# Altium project JacdacPower 50.PrjPCB
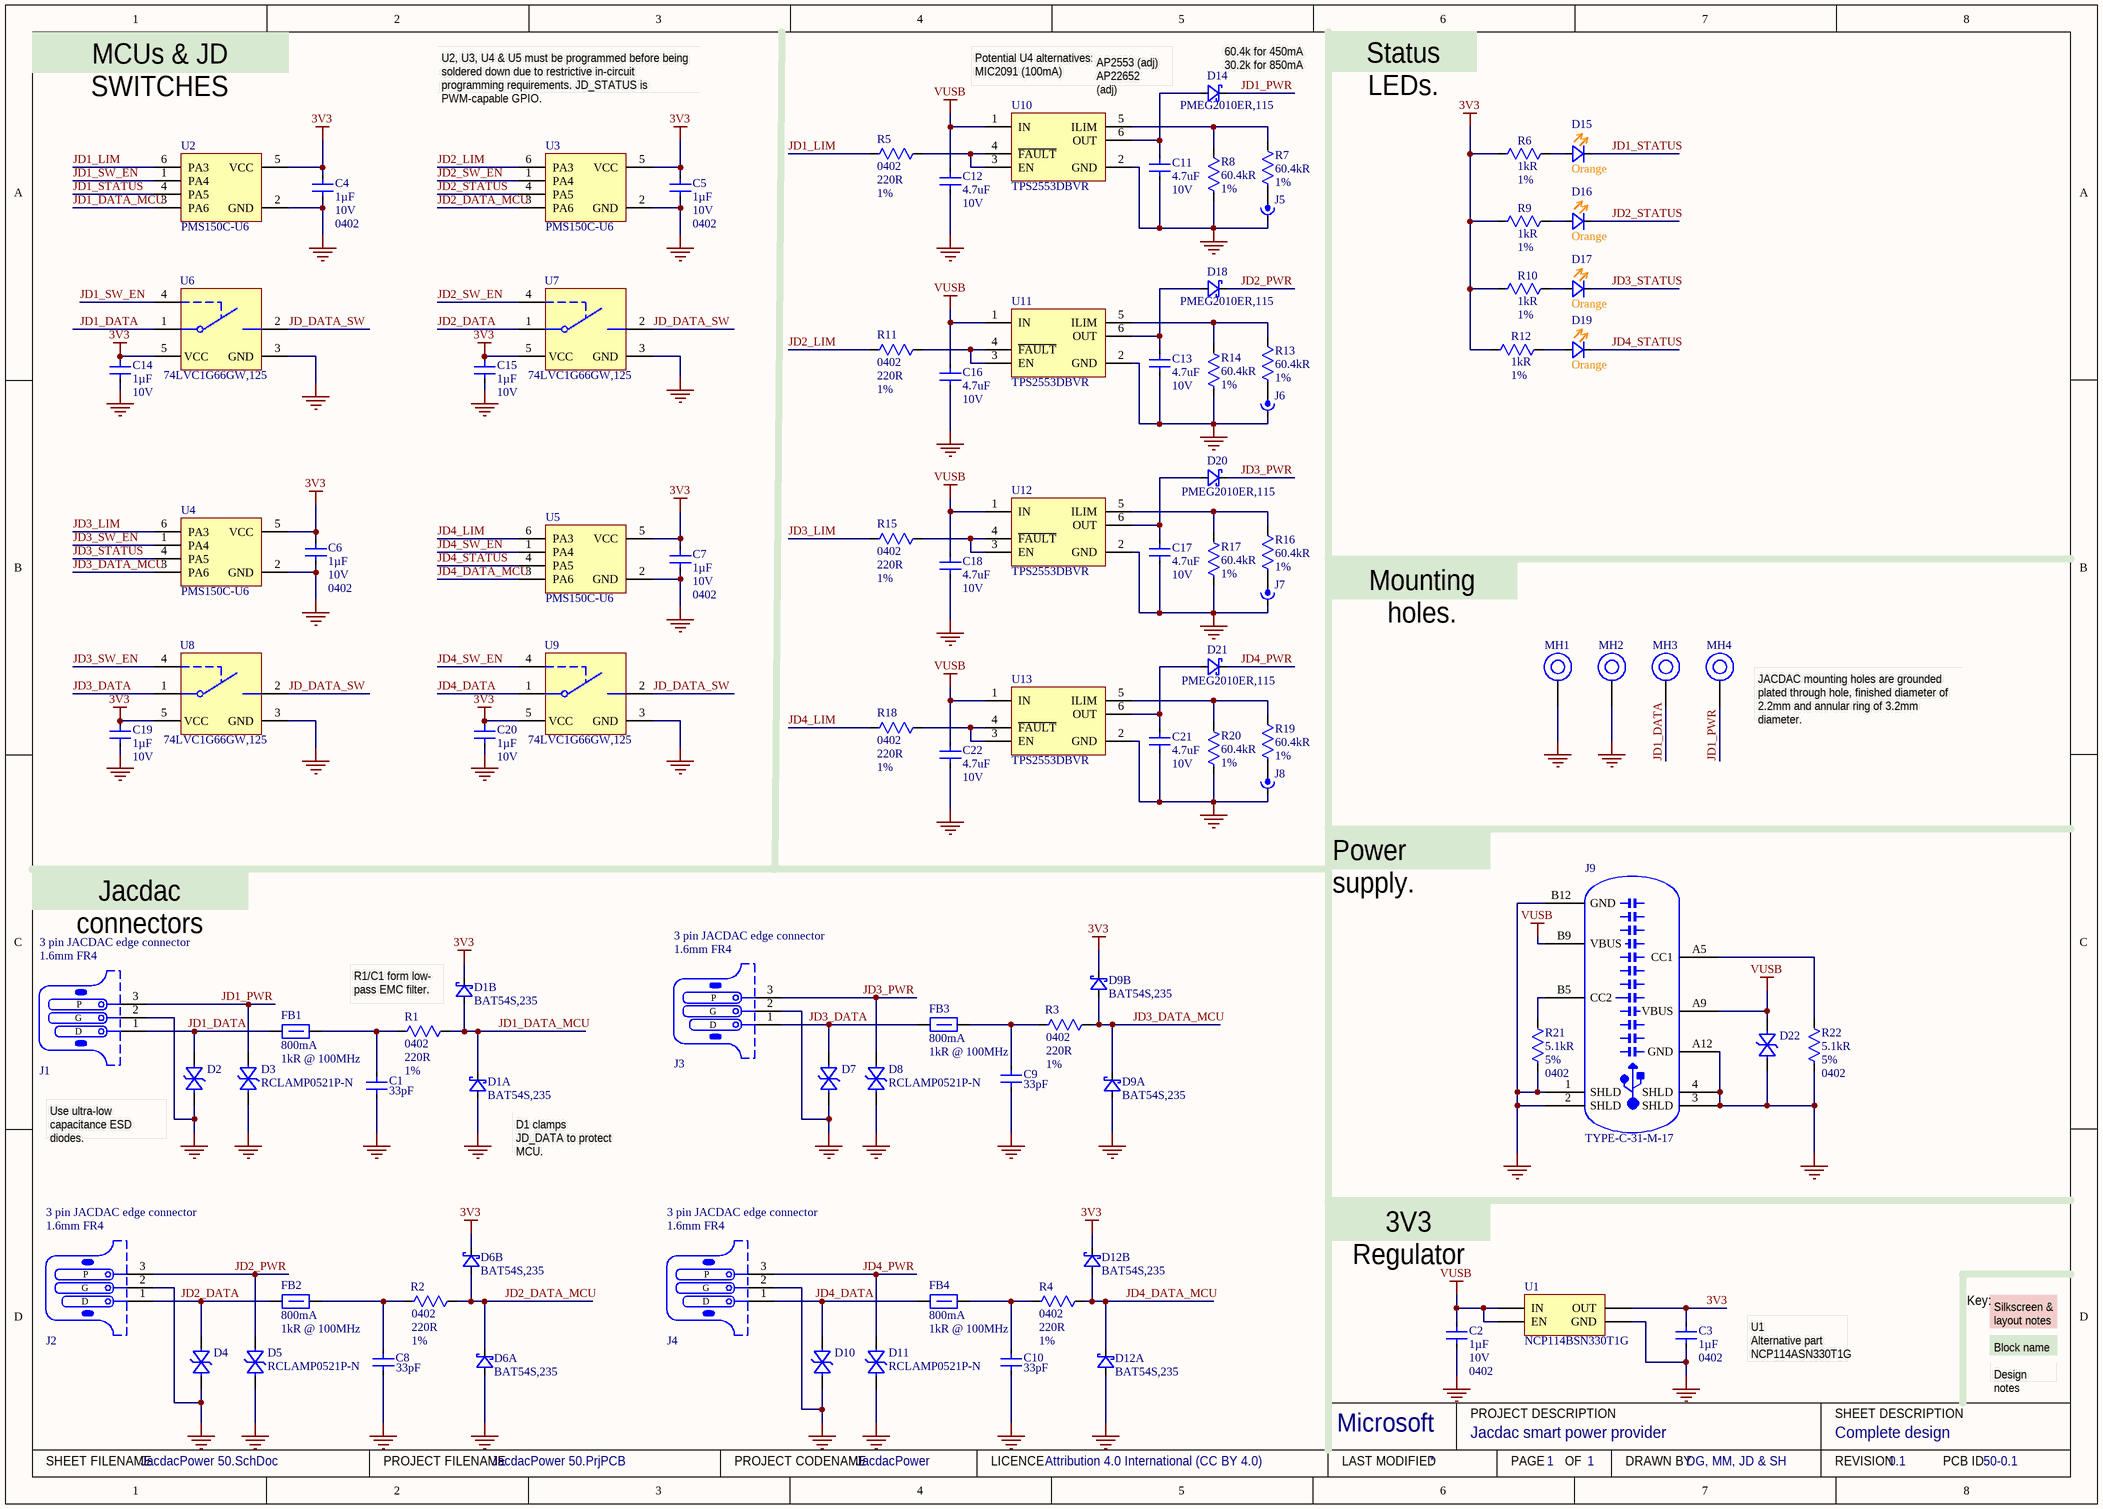
[diagram p0: JacdacPower 50.SchDoc]
ProjectCodeName: JacdacPower; ProjectCodenameDescription: Jacdac smart power provider; ProjectCodenameID: 50; ProjectDrawnBy: DG, MM, JD & SH; ProjectLicenceTerms: Attribution 4.0 International (CC BY 4.0); ProjectRevision: 0.1
1 sheet, 95 parts. Net scope: global (net labels, ports and power ports of the same name join across sheets).
Board files: JacdacPower 50.PcbDoc, Panelized JacdacPower 50.PcbDoc

## Sheet JacdacPower 50.SchDoc: Complete design
size A3; DrawnBy: DG, MM, JD & SH; DocumentNumber: 1; Revision: 0.1; SheetNumber: 1; SheetTotal: 1; VersionControl_RevNumber: 1

### Parts
C1  Capacitance: 33pF  [C0402_0.55MM - without outline]  (hidden comment: CL05C330JB5NNNC)
C2  Capacitance: 1µF  Voltage Rating: 10V  Case Code (Imperial): 0402  [C0402_0.55MM - without outline]  (hidden comment: CL05A105KP5NNNC)
C3  Capacitance: 1µF  Case Code (Imperial): 0402  [C0402_0.55MM - without outline]  (hidden comment: CL05A105KP5NNNC)
C4  Capacitance: 1µF  Voltage Rating: 10V  Case Code (Imperial): 0402  [C0402_0.55MM - without outline]  (hidden comment: CL05A105KP5NNNC)
C5  Capacitance: 1µF  Voltage Rating: 10V  Case Code (Imperial): 0402  [C0402_0.55MM - without outline]  (hidden comment: CL05A105KP5NNNC)
C6  Capacitance: 1µF  Voltage Rating: 10V  Case Code (Imperial): 0402  [C0402_0.55MM - without outline]  (hidden comment: CL05A105KP5NNNC)
C7  Capacitance: 1µF  Voltage Rating: 10V  Case Code (Imperial): 0402  [C0402_0.55MM - without outline]  (hidden comment: CL05A105KP5NNNC)
C8  Capacitance: 33pF  [C0402_0.55MM - without outline]  (hidden comment: CL05C330JB5NNNC)
C9  Capacitance: 33pF  [C0402_0.55MM - without outline]  (hidden comment: CL05C330JB5NNNC)
C10  Capacitance: 33pF  [C0402_0.55MM - without outline]  (hidden comment: CL05C330JB5NNNC)
C11  Capacitance: 4.7uF  Voltage Rating: 10V  [R0402 - Without outline]  (hidden comment: CL05A475MP5NRNC)
C12  Capacitance: 4.7uF  Voltage Rating: 10V  [R0402 - Without outline]  (hidden comment: CL05A475MP5NRNC)
C13  Capacitance: 4.7uF  Voltage Rating: 10V  [R0402 - Without outline]  (hidden comment: CL05A475MP5NRNC)
C14  Capacitance: 1µF  Voltage Rating: 10V  [C0402_0.55MM - without outline]  (hidden comment: CL05A105KP5NNNC)
C15  Capacitance: 1µF  Voltage Rating: 10V  [C0402_0.55MM - without outline]  (hidden comment: CL05A105KP5NNNC)
C16  Capacitance: 4.7uF  Voltage Rating: 10V  [R0402 - Without outline]  (hidden comment: CL05A475MP5NRNC)
C17  Capacitance: 4.7uF  Voltage Rating: 10V  [R0402 - Without outline]  (hidden comment: CL05A475MP5NRNC)
C18  Capacitance: 4.7uF  Voltage Rating: 10V  [R0402 - Without outline]  (hidden comment: CL05A475MP5NRNC)
C19  Capacitance: 1µF  Voltage Rating: 10V  [C0402_0.55MM - without outline]  (hidden comment: CL05A105KP5NNNC)
C20  Capacitance: 1µF  Voltage Rating: 10V  [C0402_0.55MM - without outline]  (hidden comment: CL05A105KP5NNNC)
C21  Capacitance: 4.7uF  Voltage Rating: 10V  [R0402 - Without outline]  (hidden comment: CL05A475MP5NRNC)
C22  Capacitance: 4.7uF  Voltage Rating: 10V  [R0402 - Without outline]  (hidden comment: CL05A475MP5NRNC)
D1  Manufacturer Part Number: BAT54S,235  [NXP-BAT54S-TO-236AB - without outline]  (hidden comment: BAT54S)  (parts A,B of 2)
D2  RCLAMP0521P-N  [TVS 0402 - without outline]  (value not drawn)
D3  RCLAMP0521P-N  [TVS 0402 - without outline]
D4  RCLAMP0521P-N  [TVS 0402 - without outline]  (value not drawn)
D5  RCLAMP0521P-N  [TVS 0402 - without outline]
D6  Manufacturer Part Number: BAT54S,235  [NXP-BAT54S-TO-236AB - without outline]  (hidden comment: BAT54S)  (parts A,B of 2)
D7  RCLAMP0521P-N  [TVS 0402 - without outline]  (value not drawn)
D8  RCLAMP0521P-N  [TVS 0402 - without outline]
D9  Manufacturer Part Number: BAT54S,235  [NXP-BAT54S-TO-236AB - without outline]  (hidden comment: BAT54S)  (parts A,B of 2)
D10  RCLAMP0521P-N  [TVS 0402 - without outline]  (value not drawn)
D11  RCLAMP0521P-N  [TVS 0402 - without outline]
D12  Manufacturer Part Number: BAT54S,235  [NXP-BAT54S-TO-236AB - without outline]  (hidden comment: BAT54S)  (parts A,B of 2)
D14  PMEG2010ER,115  [SOD-123W]
D15  Colour: Orange  [0603 Orange]  (hidden comment: 19-217/S2C-AQ1R1B/3T)
D16  Colour: Orange  [0603 Orange]  (hidden comment: 19-217/S2C-AQ1R1B/3T)
D17  Colour: Orange  [0603 Orange]  (hidden comment: 19-217/S2C-AQ1R1B/3T)
D18  PMEG2010ER,115  [SOD-123W]
D19  Colour: Orange  [0603 Orange]  (hidden comment: 19-217/S2C-AQ1R1B/3T)
D20  PMEG2010ER,115  [SOD-123W]
D21  PMEG2010ER,115  [SOD-123W]
D22  RCLAMP0521P-N  [TVS 0402 - without outline]  (value not drawn)
FB1  Current Rating: 800mA  Impedance: 1kR @ 100MHz  [TDK MPZ1608 0.8mm - without outline]  (hidden comment: TDK MPZ1608S102ATA00)
FB2  Current Rating: 800mA  Impedance: 1kR @ 100MHz  [TDK MPZ1608 0.8mm - without outline]  (hidden comment: TDK MPZ1608S102ATA00)
FB3  Current Rating: 800mA  Impedance: 1kR @ 100MHz  [TDK MPZ1608 0.8mm - without outline]  (hidden comment: TDK MPZ1608S102ATA00)
FB4  Current Rating: 800mA  Impedance: 1kR @ 100MHz  [TDK MPZ1608 0.8mm - without outline]  (hidden comment: TDK MPZ1608S102ATA00)
J1  3 pin JACDAC edge connector  PCB Type: 1.6mm FR4  [JACDAC_EDGE_CONNECTOR_0.15mm_T&G]  (no BOM)
J2  3 pin JACDAC edge connector  PCB Type: 1.6mm FR4  [JACDAC_EDGE_CONNECTOR_0.15mm_T&G]  (no BOM)
J3  3 pin JACDAC edge connector  PCB Type: 1.6mm FR4  [JACDAC_EDGE_CONNECTOR_0.15mm_T&G]  (no BOM)
J4  3 pin JACDAC edge connector  PCB Type: 1.6mm FR4  [JACDAC_EDGE_CONNECTOR_0.15mm_T&G]  (no BOM)
J5  OpenSolderBlob  [SolderBlobA]  (value not drawn)  (no BOM)
J6  OpenSolderBlob  [SolderBlobA]  (value not drawn)  (no BOM)
J7  OpenSolderBlob  [SolderBlobA]  (value not drawn)  (no BOM)
J8  OpenSolderBlob  [SolderBlobA]  (value not drawn)  (no BOM)
J9  TYPE-C-31-M-17  [TYPE-C-31-M-17]
MH1  MH_5.0MMK_3.0MMC_2.1MMD_PTH  [MH_5.0MMK_3.0MMC_2.1MMD_PTH]  (value not drawn)  (no BOM)
MH2  MH_5.0MMK_3.0MMC_2.1MMD_PTH  [MH_5.0MMK_3.0MMC_2.1MMD_PTH]  (value not drawn)  (no BOM)
MH3  MH_5.0MMK_3.0MMC_2.1MMD_PTH  [MH_5.0MMK_3.0MMC_2.1MMD_PTH]  (value not drawn)  (no BOM)
MH4  MH_5.0MMK_3.0MMC_2.1MMD_PTH  [MH_5.0MMK_3.0MMC_2.1MMD_PTH]  (value not drawn)  (no BOM)
R1  Case Code (Imperial): 0402  Resistance: 220R  Tolerance: 1%  [R0402 - Without outline]  (hidden comment: RC0402FR-07220RL)
R2  Case Code (Imperial): 0402  Resistance: 220R  Tolerance: 1%  [R0402 - Without outline]  (hidden comment: RC0402FR-07220RL)
R3  Case Code (Imperial): 0402  Resistance: 220R  Tolerance: 1%  [R0402 - Without outline]  (hidden comment: RC0402FR-07220RL)
R4  Case Code (Imperial): 0402  Resistance: 220R  Tolerance: 1%  [R0402 - Without outline]  (hidden comment: RC0402FR-07220RL)
R5  Case Code (Imperial): 0402  Resistance: 220R  Tolerance: 1%  [R0402 - Without outline]  (hidden comment: RC0402FR-07220RL)
R6  Tolerance: 1%  Resistance: 1kR  [R0402 - Without outline]  (hidden comment: RC0402FR-071KL)
R7  Resistance: 60.4kR  Tolerance: 1%  [R0402 - Without outline]  (hidden comment: RC0402FR-0760K4L)
R8  Resistance: 60.4kR  Tolerance: 1%  [R0402 - Without outline]  (hidden comment: RC0402FR-0760K4L)
R9  Tolerance: 1%  Resistance: 1kR  [R0402 - Without outline]  (hidden comment: RC0402FR-071KL)
R10  Tolerance: 1%  Resistance: 1kR  [R0402 - Without outline]  (hidden comment: RC0402FR-071KL)
R11  Case Code (Imperial): 0402  Resistance: 220R  Tolerance: 1%  [R0402 - Without outline]  (hidden comment: RC0402FR-07220RL)
R12  Tolerance: 1%  Resistance: 1kR  [R0402 - Without outline]  (hidden comment: RC0402FR-071KL)
R13  Resistance: 60.4kR  Tolerance: 1%  [R0402 - Without outline]  (hidden comment: RC0402FR-0760K4L)
R14  Resistance: 60.4kR  Tolerance: 1%  [R0402 - Without outline]  (hidden comment: RC0402FR-0760K4L)
R15  Case Code (Imperial): 0402  Resistance: 220R  Tolerance: 1%  [R0402 - Without outline]  (hidden comment: RC0402FR-07220RL)
R16  Resistance: 60.4kR  Tolerance: 1%  [R0402 - Without outline]  (hidden comment: RC0402FR-0760K4L)
R17  Resistance: 60.4kR  Tolerance: 1%  [R0402 - Without outline]  (hidden comment: RC0402FR-0760K4L)
R18  Case Code (Imperial): 0402  Resistance: 220R  Tolerance: 1%  [R0402 - Without outline]  (hidden comment: RC0402FR-07220RL)
R19  Resistance: 60.4kR  Tolerance: 1%  [R0402 - Without outline]  (hidden comment: RC0402FR-0760K4L)
R20  Resistance: 60.4kR  Tolerance: 1%  [R0402 - Without outline]  (hidden comment: RC0402FR-0760K4L)
R21  Resistance: 5.1kR  Tolerance: 5%  Case Code (Imperial): 0402  [R0402 - Without outline]  (hidden comment: RC0402JR-075K1L)
R22  Resistance: 5.1kR  Tolerance: 5%  Case Code (Imperial): 0402  [R0402 - Without outline]  (hidden comment: RC0402JR-075K1L)
U1  LDO 3.3V/300 mA  [ON_SEMI-SOT23-5 - without outline]  (value not drawn)
U2  Manufacturer Part Number: PMS150C-U6  [SOT23-6]  (hidden comment: PMS150C)
U3  Manufacturer Part Number: PMS150C-U6  [SOT23-6]  (hidden comment: PMS150C)
U4  Manufacturer Part Number: PMS150C-U6  [SOT23-6]  (hidden comment: PMS150C)
U5  Manufacturer Part Number: PMS150C-U6  [SOT23-6]  (hidden comment: PMS150C)
U6  74LVC1G66GW,125  [TSSOP-5/SOT353-1]
U7  74LVC1G66GW,125  [TSSOP-5/SOT353-1]
U8  74LVC1G66GW,125  [TSSOP-5/SOT353-1]
U9  74LVC1G66GW,125  [TSSOP-5/SOT353-1]
U10  TPS2553DBVR  [TI-TPS2553 - without_outline]
U11  TPS2553DBVR  [TI-TPS2553 - without_outline]
U12  TPS2553DBVR  [TI-TPS2553 - without_outline]
U13  TPS2553DBVR  [TI-TPS2553 - without_outline]

### Nets
3V3: C3.2 C4.2 C5.2 C6.2 C7.2 C14.2 C15.2 C19.2 C20.2 D1.2(K) D6.2(K) D9.2(K) D12.2(K) R6.2 R9.2 R10.2 R12.2 U1.5(OUT) U2.5(VCC) U3.5(VCC) U4.5(VCC) U5.5(VCC) U6.5(VCC) U7.5(VCC) U8.5(VCC) U9.5(VCC)
GND: C1.1 C2.1 C3.1 C4.1 C5.1 C6.1 C7.1 C8.1 C9.1 C10.1 C11.1 C12.1 C13.1 C14.1 C15.1 C16.1 C17.1 C18.1 C19.1 C20.1 C21.1 C22.1 D1.1(A) D2.2(A) D3.2(A) D4.2(A) D5.2(A) D6.1(A) D7.2(A) D8.2(A) D9.1(A) D10.2(A) D11.2(A) D12.1(A) D22.2(A) J1.2(G) J2.2(G) J3.2(G) J4.2(G) J5.2 J6.2 J7.2 J8.2 J9.1(SHLD) J9.2(SHLD) J9.3(SHLD) J9.4(SHLD) J9.A12(GND) J9.B12(GND) MH1.1 MH2.1 R8.1 R14.1 R17.1 R20.1 R21.2 R22.2 U1.2(GND) U2.2(GND) U3.2(GND) U4.2(GND) U5.2(GND) U6.3(GND) U7.3(GND) U8.3(GND) U9.3(GND) U10.2(GND) U11.2(GND) U12.2(GND) U13.2(GND)
VUSB: C2.2 C12.2 C16.2 C18.2 C22.2 D22.1(K) J9.A9(VBUS) J9.B9(VBUS) U1.1(IN) U1.3(EN) U10.1(IN) U11.1(IN) U12.1(IN) U13.1(IN)
JD1_DATA: D2.1(K) FB1.1 J1.1(D) MH3.1 U6.1(Y)
JD1_DATA_MCU: D1.3(K) R1.1 U2.3(PA6)
JD1_LIM: R5.2 U2.6(PA3)
JD1_PWR: D3.1(K) D14.1(K) J1.3(P) MH4.1
JD1_STATUS: D15.1(K) U2.4(PA5)
JD1_SW_EN: U2.1(PA4) U6.4(EN)
JD2_DATA: D4.1(K) FB2.1 J2.1(D) U7.1(Y)
JD2_DATA_MCU: D6.3(K) R2.1 U3.3(PA6)
JD2_LIM: R11.2 U3.6(PA3)
JD2_PWR: D5.1(K) D18.1(K) J2.3(P)
JD2_STATUS: D16.1(K) U3.4(PA5)
JD2_SW_EN: U3.1(PA4) U7.4(EN)
JD3_DATA: D7.1(K) FB3.1 J3.1(D) U8.1(Y)
JD3_DATA_MCU: D9.3(K) R3.1 U4.3(PA6)
JD3_LIM: R15.2 U4.6(PA3)
JD3_PWR: D8.1(K) D20.1(K) J3.3(P)
JD3_STATUS: D17.1(K) U4.4(PA5)
JD3_SW_EN: U4.1(PA4) U8.4(EN)
JD4_DATA: D10.1(K) FB4.1 J4.1(D) U9.1(Y)
JD4_DATA_MCU: D12.3(K) R4.1 U5.3(PA6)
JD4_LIM: R18.2 U5.6(PA3)
JD4_PWR: D11.1(K) D21.1(K) J4.3(P)
JD4_STATUS: D19.1(K) U5.4(PA5)
JD4_SW_EN: U5.1(PA4) U9.4(EN)
JD_DATA_SW: U6.2(Z) U7.2(Z) U8.2(Z) U9.2(Z)
NetC1_2: C1.2 FB1.2 R1.2
NetC8_2: C8.2 FB2.2 R2.2
NetC9_2: C9.2 FB3.2 R3.2
NetC10_2: C10.2 FB4.2 R4.2
NetC11_2: C11.2 D14.2(A) U10.6(OUT)
NetC13_2: C13.2 D18.2(A) U11.6(OUT)
NetC17_2: C17.2 D20.2(A) U12.6(OUT)
NetC21_2: C21.2 D21.2(A) U13.6(OUT)
NetD15_2: D15.2(A) R6.1
NetD16_2: D16.2(A) R9.1
NetD17_2: D17.2(A) R10.1
NetD19_2: D19.2(A) R12.1
NetJ5_1: J5.1 R7.1
NetJ6_1: J6.1 R13.1
NetJ7_1: J7.1 R16.1
NetJ8_1: J8.1 R19.1
NetJ9_A5: J9.A5(CC1) R22.1
NetJ9_B5: J9.B5(CC2) R21.1
NetR5_1: R5.1 U10.3(EN) U10.4(~{FAULT})
NetR7_2: R7.2 R8.2 U10.5(ILIM)
NetR11_1: R11.1 U11.3(EN) U11.4(~{FAULT})
NetR13_2: R13.2 R14.2 U11.5(ILIM)
NetR15_1: R15.1 U12.3(EN) U12.4(~{FAULT})
NetR16_2: R16.2 R17.2 U12.5(ILIM)
NetR18_1: R18.1 U13.3(EN) U13.4(~{FAULT})
NetR19_2: R19.2 R20.2 U13.5(ILIM)

### Notes on the sheet
- MCUs & JD SWITCHES
- U2, U3, U4 & U5 must be programmed before being soldered down due to restrictive in-circuit programming requirements. JD_STATUS is PWM-capable GPIO.
- Potential U4 alternatives:
  MIC2091 (100mA)
- AP2553 (adj)
  AP22652 (adj)
- (near D14) 60.4k for 450mA
  30.2k for 850mA
- Status LEDs.
- Mounting holes.
- (near MH4) JACDAC mounting holes are grounded plated through hole, finished diameter of 2.2mm and annular ring of 3.2mm diameter.
- Jacdac connectors
- Power supply.
- R1/C1 form low-
  pass EMC filter.
- (near D2) Use ultra-low capacitance ESD diodes.
- (near D1) D1 clamps JD_DATA to protect MCU.
- 3V3 Regulator
- Key:
- Silkscreen & layout notes
- U1
  Alternative part
  NCP114ASN330T1G
- Block name
- Design notes
- Microsoft
- PROJECT DESCRIPTION
- SHEET DESCRIPTION
- SHEET FILENAME
- PROJECT FILENAME
- PROJECT CODENAME
- LICENCE
- LAST MODIFIED
- PAGE
- OF
- DRAWN BY
- REVISION
- PCB ID

### Library data of the parts
C1 C8-C10 = CL05C330JB5NNNC: CAP CER 33PF 50V C0G/NP0 0402; Manufacturer: Samsung; Material: Ceramic; Tolerance: 5%; Dielectric: C0G; Temperature Coefficient: 300ppm/°C; Supplier 1: Digi-Key; Manufacturer Part Number: CL05C330JB5NNNC; RoHS: Yes; Category: Ceramic Capacitors; Stock 1: 5436088; Pricing 1: 1=0.10000, 10=0.02300, 50=0.01260, 100=0.01040, 500=0.00740, 1000=0.00582, 2500=0.00529, 5000=0.00487 (USD); Mount: Surface Mount; Case Code (Metric): 1005; Case Code (Imperial): 0402; Contact Plating: Tin; Min Operating Temperature: -55°C; Max Operating Temperature: 125°C; Package Quantity: 1; Packaging: Tape and Reel; Voltage: 50V; Voltage Rating (DC): 50V; Series: CL; Construction: Flat; Length: 1mm; Width: 0.02inch; Height: 0.5mm; Thickness: 0.022inch; Depth: 0.5mm; Radiation Hardening: No; Lead Free: Lead Free; RoHS Compliant: Yes; ComponentLink1URL: https://datasheet.ciiva.com/15195/getdatasheetpartid-355282-15195687.pdf; ComponentLink1Description: Online datasheet; Supplier 2: Newark; Stock 2: 45340; Pricing 2: 1=0.12500, 25=0.02900, 100=0.01300, 250=0.01100, 500=0.00900, 1000=0.00600 (USD); Supplier 3: Mouser; Stock 3: 8877; Pricing 3: 1=0.10000, 10=0.01400, 50=0.01400, 100=0.01100, 1000=0.00600, 10000=0.00400 (USD); Supplier 4: Farnell; Stock 4: 10934; Pricing 4: 150=0.01120, 500=0.00860, 2500=0.00640, 5000=0.00550 (GBP); Supplier Part Number 4: 3013373RL; Supplier Part Number 3: 187-CL05C330JB5NNNC; Supplier Part Number 2: 82AC9259; Supplier Part Number 1: 1276-1272-1-ND; Voltage Rating: 50V; Case/Package: 0402
C2-C7 C14 C15 C19 C20 = CL05A105KP5NNNC: CAP CER 1UF 10V X5R 0402; Manufacturer: Samsung; Material: Ceramic; Tolerance: 10%; Supplier 1: Digi-Key; Manufacturer Part Number: CL05A105KP5NNNC; RoHS: Yes; Category: Capacitors; Stock 1: 5705569; Pricing 1: 1=0.10000, 10=0.03900, 50=0.02100, 100=0.01720, 500=0.01228, 1000=0.00965, 2500=0.00877, 5000=0.00807 (USD); Mount: Surface Mount; Case/Package: 0402; Case Code (Metric): 1005; Contact Plating: Tin; Min Operating Temperature: -55°C; Max Operating Temperature: 85°C; Dielectric: X5R; Package Quantity: 1; Packaging: Tape and Reel; Length: 1mm; Height: 0.5mm; Width: 0.02inch; Thickness: 0.022inch; Depth: 0.5mm; Radiation Hardening: No; ComponentLink1URL: https://datasheet.ciiva.com/15195/getdatasheetpartid-358390-15195630.pdf; ComponentLink1Description: Online datasheet; Supplier 2: Mouser; Stock 2: 928941; Pricing 2: 1=0.10000, 10=0.04200, 100=0.01800, 500=0.01300, 1000=0.01000, 2500=0.00900 (USD); Supplier 3: Farnell; Stock 3: 53670; Pricing 3: 10=0.02450, 100=0.02000, 500=0.01310, 2500=0.00920, 5000=0.00810, 10000=0.00640, 50000=0.00490 (GBP); Supplier Part Number 3: 3013329; Supplier Part Number 2: 187-CL05A105KP5NNNC; Supplier Part Number 1: 1276-1076-1-ND; Created: DG; Checked: ?
  C3: Voltage Rating: 10V
  C14 C15 C19 C20: Case Code (Imperial): 0402
C11-C13 C16-C18 C21 C22 = CL05A475MP5NRNC: CAP CER 4.7UF 10V X5R 0402; Manufacturer: Samsung; Tolerance: 20%; Supplier 1: Digi-Key; Manufacturer Part Number: CL05A475MP5NRNC; RoHS: Yes; Category: Ceramic Capacitors; Stock 1: 840000; Pricing 1: 10000=0.01405, 20000=0.01338 (USD); Mount: Surface Mount; Case/Package: 0402; Case Code (Metric): 1005; Min Operating Temperature: -55°C; Max Operating Temperature: 85°C; Package Quantity: 10000; Packaging: Tape and Reel; Dielectric: X5R; Series: CL; Length: 0.039inch; Width: 0.02inch; Thickness: 0.022inch; Lead Free: Lead Free; RoHS Compliant: Yes; ComponentLink1URL: https://datasheet.ciiva.com/25786/cl05a475mp5nrnc-25786963.pdf; ComponentLink1Description: Online datasheet; Supplier 2: Future Electronics; Stock 2: 2004; Pricing 2: 1=0.23500, 500=0.03970, 1500=0.02900, 2500=0.02500, 5000=0.02050 (USD); Created By: D. Gakure; Checked By: ?; Supplier Part Number 2: 2103694; Supplier Part Number 1: 1276-1482-2-ND; Case Code (Imperial): 0402
D1 D6 D9 D12 = BAT54S: DIODE ARRAY SCHOTTKY 30V SOT23; Manufacturer: Nexperia; Supplier 1: Digi-Key; RoHS: No; Category: Rectifier Diodes; Stock 1: 14011; Pricing 1: 1=0.13000, 10=0.11900, 100=0.05610, 500=0.03326, 1000=0.02185, 5000=0.02138 (USD); ComponentLink1URL: https://assets.nexperia.com/documents/data-sheet/BAT54_SER.pdf; ComponentLink1Description: NXP datasheet online; Supplier 2: Mouser; Supplier 3: RSComponents; Supplier Part Number 2: 771-BAT54S235; Supplier Part Number 3: 1707990; Supplier Part Number 1: 1727-1868-1-ND
D2-D5 D7 D8 D10 D11 D22 = RCLAMP0521P-N: Bidirectional 5V (Max) 6V 16V 3.5A (8/20us) 0402 TVS RoHS; Manufacturer: Born Semiconductor; Package: 0402; Created By: D Gakure; Checked By: ?; Supplier1: LCSC; Supplier1 Part Number: C316043; ComponentLink1Description: Online datasheet; ComponentLink1URL: https://datasheet.lcsc.com/szlcsc/Bourne-Semicon-Shenzhen-RCLAMP0521P-N_C316043.pdf; Manufacturer Part Number: RCLAMP0521P-N
D14 D18 D20 D21 = PMEG2010ER,115: NEXPERIA - PMEG2010ER,115 - DIODE, RECT SCH, 20V, 1A, SOD123W; Supplier 1: Digi-Key; Manufacturer: Nexperia; RoHS: Yes; Stock 1: 722; Pricing 1: 1=0.42000, 10=0.31300, 100=0.19480, 500=0.13328, 1000=0.10252 (USD); RoHS Compliant: Yes; ComponentLink1URL: http://www.farnell.com/datasheets/1383341.pdf; ComponentLink1Description: Online datasheet; Supplier 2: Future Electronics; Stock 2: 144000; Pricing 2: 3000=0.20000, 6000=0.16300, 9000=0.16200, 12000=0.16100, 15000=0.16000 (USD); Supplier 3: RSComponents; Stock 3: 1; Pricing 3: 50=0.32100, 100=0.26700, 250=0.21200, 500=0.11100, 1000=0.08200 (USD); Supplier 4: Mouser; Stock 4: 2146; Pricing 4: 1=0.37000, 10=0.25700, 50=0.25700, 100=0.13400, 1000=0.09400, 10000=0.07200 (USD); Supplier 5: Farnell; Stock 5: 24250; Pricing 5: 5=0.40400, 10=0.27600, 100=0.13400, 500=0.11500, 1000=0.07750 (GBP); Supplier Part Number 5: 1907681; Supplier Part Number 4: 771-PMEG2010ER115; Supplier Part Number 3: 8166824P; Supplier Part Number 2: 4222907; Supplier Part Number 1: 1727-5192-1-ND; Manufacturer Part Number: PMEG2010ER,115
D15-D17 D19 = 19-217/S2C-AQ1R1B/3T: LED ORANGE DIFFUSED 0603 SMD; Manufacturer: Everlight Elec; Manufacturer Part Number: 19-217/S2C-AQ1R1B/3T; Mount: Surface Mount; Case/Package: 0603; Color: Orange; Case Code (Imperial): 0603; ComponentLink1URL: https://datasheet.lcsc.com/lcsc/1912171731_Everlight-Elec-19-217-S2C-AQ1R1B-3T_C146215.pdf; ComponentLink1Description: Online datasheet; Supplier 1: LCSC; Supplier 1 Part Number: C146215
FB1-FB4 = TDK MPZ1608S102ATA00: 0603 1k@100MHz 0.8A chip; Core Material: Ferrite; Tolerance: 25%; DC Resistance (DCR): 300mR; Supplier 1: Digi-Key; Stock 1: 113542; Pricing 1: 1=0.1, 10=0.079, 25=0.0716, 50=0.0644, 100=0.0472, 250=0.03432, 500=0.03146, 1000=0.02717 (USD); Mount: Surface Mount; Case/Package: 0603; Case Code (Metric): 1608; Case Code (Imperial): 0603; Package Quantity: 4000; Packaging: Tape and Reel; Max DC Current: 800mA; Length: 0.063inch; Height: 0.037inch; Width: 0.031inch; ComponentLink2URL: https://www.mouser.co.uk/datasheet/2/400/eads_commercial_power_mpz1608_en-923650.pdf; ComponentLink2Description: datasheet online; Supplier 2: Mouser; ComponentLink3Description: datasheet; ComponentLink3URL: Y:\System\Altium\Libraries 2014\TDK\Datasheets\eads_commercial_power_mpz1608_en-923650.pdf; Supplier Part Number 1: 445-8694-1-ND; Supplier Part Number 2: 810-MPZ1608S102ATA00; Manufacturer: TDK; Manufacturer Part Number: MPZ1608S102ATA00
J1-J4 = Jacdac edge connector: 3 pin Jacdac edge connector 1.27mm pitch; Manufacturer Part Number: JACDAC_EDGE_CONNECTOR; Checked By: ?; Created By: D. Gakure; ComponentLink1Description: Yuliang JACDAC cable connector drawing online; ComponentLink1URL: https://github.com/microsoft/jacdac-mdk/blob/main/connector/JACDAC-Connector-by-Yuliang-2020-11-28.pdf; ComponentLink2Description: JACDAC PCB edge connector spec onlin; ComponentLink2URL: https://github.com/microsoft/jacdac-mdk/blob/main/connector/JACDAC_PCB_Edge_Connector_Drawing_JD-PEC-01_rev_01.pdf
J5-J8 = OpenSolderBlob: Open solder blob
J9 = TYPE-C-31-M-17: USB - Type C Female 6 USB Connectors RoHS; Manufacturer: Korean Hroparts Elec; Gender: Receptacle; Number of Positions: 6; RoHS: Yes; Category: USB Connectors; Orientation: Right Angle; ComponentLink1URL: https://datasheet.lcsc.com/szlcsc/1811101526_Korean-Hroparts-Elec-TYPE-C-31-M-17_C283540.pdf; ComponentLink1Description: Online datasheet; Supplier 1 Part Number: C283540; Supplier 1: LCSC; Manufacturer Part Number: TYPE-C-31-M-17
MH1-MH4 = MH_5.0MMK_3.0MMC_2.1MMD_PTH: Mounting Hole 5.0mm keepout, 3.0mm annualar ring and 2.1mm Drill PTH
R1-R5 R11 R15 R18 = RC0402FR-07220RL: RES SMD 220 OHM 1% 1/16W 0402; Manufacturer: Yageo; Power Rating: 62.5mW; Voltage Rating: 50V; Temperature Coefficient: 100ppm/°C; Max Power Dissipation: 63mW; Supplier 1: Digi-Key; Manufacturer Part Number: RC0402FR-07220RL; RoHS: Yes; Category: Resistors; Stock 1: 1286042; Pricing 1: 1=0.10000, 10=0.01400, 100=0.00580, 1000=0.00262, 2500=0.00228, 5000=0.00188 (USD); Case/Package: 0402; Number of Pins: 2; Case Code (Metric): 1005; Min Operating Temperature: -55°C; Max Operating Temperature: 155°C; Packaging: Tape and Reel; Voltage Rating (DC): 50V; Package Quantity: 1; Termination: SMD/SMT; Resistor Type: Thick Film; Number of Terminations: 2; Features: Moisture Resistant; Length: 1mm; Height: 0.016inch; Width: 0.02inch; Depth: 0.5mm; REACH SVHC: No SVHC; Military Standard: Not; Lead Free: Lead Free; ComponentLink1URL: https://datasheet.ciiva.com/11819/0900766b80c66297-11819466.pdf; ComponentLink1Description: Online datasheet; Supplier 2: Mouser; Stock 2: 324625; Pricing 2: 1=0.10000, 10=0.01200, 100=0.00400, 1000=0.00400, 2500=0.00400, 10000=0.00300 (USD); Supplier 3: Farnell; Stock 3: 18234; Pricing 3: 1=0.08130, 25=0.01210, 100=0.01120, 250=0.01030, 500=0.00900 (GBP); Supplier Part Number 3: 2147864; Supplier Part Number 2: 603-RC0402FR-07220RL; Supplier Part Number 1: 311-220LRCT-ND; Created: D.G; Checked: ?
R6 R9 R10 R12 = RC0402FR-071KL: RES SMD 1K OHM 1% 1/16W 0402; Manufacturer: Yageo; Temperature Coefficient: 100ppm/°C; Voltage Rating (DC): 50V; Power Rating: 62.5mW; Supplier 1: Digi-Key; Manufacturer Part Number: RC0402FR-071KL; RoHS: Yes; Category: Resistors; Stock 1: 37591306; Pricing 1: 1=0.10000, 10=0.01400, 100=0.00580, 1000=0.00262, 2500=0.00228, 5000=0.00188 (USD); Case/Package: 0402; Number of Pins: 2; Case Code (Imperial): 0402; Case Code (Metric): 1005; Min Operating Temperature: -55°C; Max Operating Temperature: 155°C; Resistor Type: Thick Film; Packaging: Tape and Reel; Voltage Rating: 50V; Termination: SMD/SMT; Length: 1mm; Height: 0.32mm; Width: 0.5mm; Depth: 0.5mm; REACH SVHC: Unknown; Lead Free: Lead Free; Military Standard: Not; ComponentLink2URL: https://datasheet.ciiva.com/12666/pyu-rc0402-51-rohs-l-6-r-12666741.pdf; ComponentLink2Description: Online datasheet; Supplier 2: Mouser; Stock 2: 11912978; Pricing 2: 1=0.10000, 10=0.01200, 100=0.00400, 1000=0.00400, 2500=0.00400, 10000=0.00300 (USD); Supplier 3: Farnell; Stock 3: 29900; Pricing 3: 1=0.08130, 25=0.01210, 100=0.01120, 250=0.01030, 500=0.00900 (GBP); Supplier Part Number 3: 2132441; Supplier Part Number 2: 603-RC0402FR-071KL; Supplier Part Number 1: 311-1.00KLRDKR-ND; Created: D.G; Checked: ?
R7 R8 R13 R14 R16 R17 R19 R20 = RC0402FR-0760K4L: RES SMD 60.4K OHM 1% 1/16W 0402; Manufacturer: Yageo; Temperature Coefficient: 100ppm/°C; Power Rating: 62.5mW; Voltage Rating: 50V; Max Power Dissipation: 63mW; Supplier 1: Digi-Key; Manufacturer Part Number: RC0402FR-0760K4L; RoHS: Yes; Category: Chip SMD Resistors; Stock 1: 412197; Pricing 1: 1=0.10000, 10=0.01600, 100=0.00660, 1000=0.00299, 2500=0.00259, 5000=0.00214 (USD); Case/Package: 0402; Contact Plating: Tin,Matte; Case Code (Imperial): 0402; Case Code (Metric): 1005; Size Code: 0402; Min Operating Temperature: -55°C; Max Operating Temperature: 155°C; Resistor Type: Thick Film; Packaging: Tape and Reel; Termination: SMD/SMT; Voltage Rating (DC): 50V; Features: Moisture Resistant; Series: RC; Number of Terminations: 2; Construction: Rectangular; Length: 1mm; Width: 500um; Depth: 0.5mm; Military Standard: Not; Lead Free: Lead Free; RoHS Compliant: Yes; ComponentLink1URL: https://datasheet.ciiva.com/17068/pyu-rc0402-51-rohs-l-6-r-17068614.pdf; ComponentLink1Description: Online datasheet; Supplier 2: Farnell; Stock 2: 63870; Pricing 2: 10=0.00880, 100=0.00810, 500=0.00740, 2500=0.00510, 5000=0.00420, 10000=0.00360, 50000=0.00240 (GBP); Supplier 3: RSComponents; Stock 3: 19800; Pricing 3: 10000=0.00300 (GBP); Supplier Part Number 3: 1987844; Supplier Part Number 2: 3495651; Supplier Part Number 1: 311-60.4KLRCT-ND
R21 R22 = RC0402JR-075K1L: RES SMD 5.1K OHM 5% 1/16W 0402; Manufacturer: Yageo; Voltage Rating: 50V; Power Rating: 62.5mW; Temperature Coefficient: 100ppm/°C; Max Power Dissipation: 63mW; Supplier 1: Digi-Key; Manufacturer Part Number: RC0402JR-075K1L; RoHS: Yes; Category: Chip SMD Resistors; Stock 1: 1270619; Pricing 1: 1=0.10000, 10=0.01300, 100=0.00520, 1000=0.00233, 2500=0.00202, 5000=0.00167 (USD); Case/Package: 0402; Case Code (Metric): 1005; Weight: 2.3E-05oz; Size Code: 0402; Min Operating Temperature: -55°C; Max Operating Temperature: 155°C; Packaging: Tape and Reel; Resistor Type: Thick Film; Termination: SMD/SMT; Voltage Rating (DC): 50V; Features: Moisture Resistant; Series: RC; Number of Terminations: 2; Construction: Rectangular; Resistance Tolerance: 5%; Length: 1mm; Width: 0.5mm; Height: 0.35mm; Depth: 0.5mm; REACH SVHC: No SVHC; Military Standard: Not; Lead Free: Lead Free; RoHS Compliant: Yes; ComponentLink2URL: https://datasheet.ciiva.com/16740/pyu-rc0402-51-rohs-l-6-r-16740925.pdf; ComponentLink2Description: Onnline datasheet; Supplier 2: Newark; Stock 2: 1265; Pricing 2: 1=0.10000, 25=0.01000, 100=0.00400, 250=0.00400, 500=0.00300, 1000=0.00300 (USD); Supplier 3: Mouser; Stock 3: 100817; Pricing 3: 1=0.10000, 10=0.01000, 50=0.01000, 100=0.00400, 1000=0.00300, 10000=0.00200 (USD); Supplier 4: Farnell; Stock 4: 68890; Pricing 4: 10=0.00910, 100=0.00390, 500=0.00320, 2500=0.00240, 5000=0.00210, 10000=0.00190, 50000=0.00150 (GBP); Supplier 5: Farnell; Stock 5: 1265; Pricing 5: 10000=0.00270 (GBP); Supplier Part Number 5: 1799293; Supplier Part Number 4: 3495714; Supplier Part Number 3: 603-RC0402JR-075K1L; Supplier Part Number 2: 68R0016; Supplier Part Number 1: 311-5.1KJRCT-ND; Created By: D. Gakure; Checked By: ?
U1 = NCP114BSN330T1G: CMOS Low Dropout Regulator (LDO), 300 mA 3.3V, Non-Active Discharge, TSOP5; Manufacturer: ON Semiconductor; Polarity: Positive; Quiescent Current: 50uA; Max Input Voltage: 5.5V; Min Input Voltage: 1.7V; Max Output Current: 300mA; Number of Outputs: 1; Accuracy: 2%; Output Type: Fixed; Supplier 1: Digi-Key; RoHS: Yes; Category: Voltage Regulators - Linear; Stock 1: 4067; Pricing 1: 1=0.45000, 10=0.33700, 25=0.29440, 100=0.19060, 250=0.15780, 500=0.12624, 1000=0.09679 (USD); Mount: Surface Mount; Case/Package: TSOP; Number of Pins: 5; Min Operating Temperature: -40°C; Max Operating Temperature: 85°C; Output Voltage: 3.3V; Lead Free: Lead Free; RoHS Compliant: Yes; ComponentLink1URL: http://www.farnell.com/datasheets/2118270.pdf?src-supplier=Farnell; ComponentLink1Description: Datasheet (online); Supplier 2: Mouser; Supplier 3: RSComponents; Supplier Part Number 2: 863-NCP114BSN330T1G; Supplier Part Number 3: 1263179; Supplier Part Number 1: NCP114BSN330T1GOSCT-ND; Manufacturer Part Number: NCP114BSN330T1G
U2-U5 = PMS150C: 8bit OTP Type IO Controller; Manufacturer: PADAUK; ComponentLink1Description: Padauk datasheet online; ComponentLink1URL: http://www.padauk.com.tw/upload/doc/PMS15A,PMS150C%20datasheet%20V108_EN_20200724.pdf; Supplier 1: LCSC; Supplier Part Number 1: C168658; Package: SOT-23-6; Pricing 1: 1=0.6, 10=0.0595, 100=0.0449; Stock 1: 0; Supplier Order Qty 1: 3000
U6-U9 = 74LVC1G66GW,125: Analog Switch Single SPST 5-Pin TSSOP T/R; Manufacturer: Nexperia; Supplier 1: Digi-Key; RoHS: Yes; Category: Decoders and Multiplexers; Pricing 1: 1=0.41000, 10=0.34000, 25=0.28440, 100=0.18010, 250=0.13900, 500=0.11846, 1000=0.08055 (USD); ComponentLink1URL: https://www.mouser.com/ds/2/302/74LVC1G66-1151275.pdf?src-supplier=Mouser; ComponentLink1Description: Online datasheet; Supplier 2: Newark; Stock 2: 1; Pricing 2: 5=0.35500, 10=0.28900, 25=0.24200, 50=0.19900, 100=0.15500, 250=0.12200 (USD); Supplier 3: RSComponents; Stock 3: 1; Pricing 3: 50=0.28600, 100=0.11900, 250=0.11500, 500=0.10800, 1000=0.10000 (USD); Supplier 4: Mouser; Stock 4: 3; Pricing 4: 1=0.36000, 10=0.28400, 50=0.28400, 100=0.13700, 1000=0.07600, 10000=0.06500 (USD); Supplier Part Number 4: 771-74LVC1G66GW-G; Supplier Part Number 3: 0510386; Supplier Part Number 2: 03P2780; Supplier Part Number 1: 1727-4118-6-ND; Manufacturer Part Number: 74LVC1G66GW,125
U10-U13 = TPS2553DBVR: POWER LOAD SWITCH, HIGH SIDE, SOT-23-6; Power Load Switch Type:High Side; Input Voltage:6.5V; Current Limit:1.7A; On State Resistance:0.085ohm; Distribution Switch Case Style:SOT-23; No. of Pins:6; Thermal Protection:Yes; On / Enable;RoHS Compliant: Yes; Manufacturer 1: Texas Instruments; Number of Outputs: 1; Min Supply Voltage: 2.5V; Max Supply Voltage: 6.5V; On-State Resistance: 85mR; Output Current: 1.5A; Max Power Dissipation: 625mW; Supplier 1: Digi-Key; RoHS: Yes; Category: Hot Swap Controllers; Stock 1: 14713; Pricing 1: 1=1.20000, 10=1.07100, 25=1.01640, 100=0.78050, 250=0.68972, 500=0.65340, 1000=0.50820 (USD); Case/Package: SOT-23; Number of Pins: 6; Weight: 0.00127oz; Min Operating Temperature: -40°C; Max Operating Temperature: 85°C; Packaging: Tape and Reel; Package Quantity: 1; Max Input Voltage: 6.5V; Min Input Voltage: 2.5V; Radiation Hardening: No; Lead Free: Lead Free; REACH SVHC: No SVHC; ComponentLink1URL: https://datasheet.ciiva.com/15108/getdatasheetpartid-297517-15108509.pdf; ComponentLink1Description: Online datasheet; Supplier 2: Farnell; Supplier 3: Mouser; Supplier Part Number 3: 595-TPS2553DBVR; Supplier Part Number 2: 3124082; Supplier Part Number 1: 296-32464-1-ND; Manufacturer Part Number: TPS2553DBVR

## Assembly variants
JLCPCB: alternate parts R7 -> 0402WGF6042TCE, R8 -> 0402WGF6042TCE, R13 -> 0402WGF6042TCE, R14 -> 0402WGF6042TCE, R16 -> 0402WGF6042TCE, R17 -> 0402WGF6042TCE, R19 -> 0402WGF6042TCE, R20 -> 0402WGF6042TCE, D14 -> RB161MM-20TR, D18 -> RB161MM-20TR, D20 -> RB161MM-20TR, D21 -> RB161MM-20TR